# EAGLE design Porter (EAGLE 7.5.0)

## Sheet 1 of 2
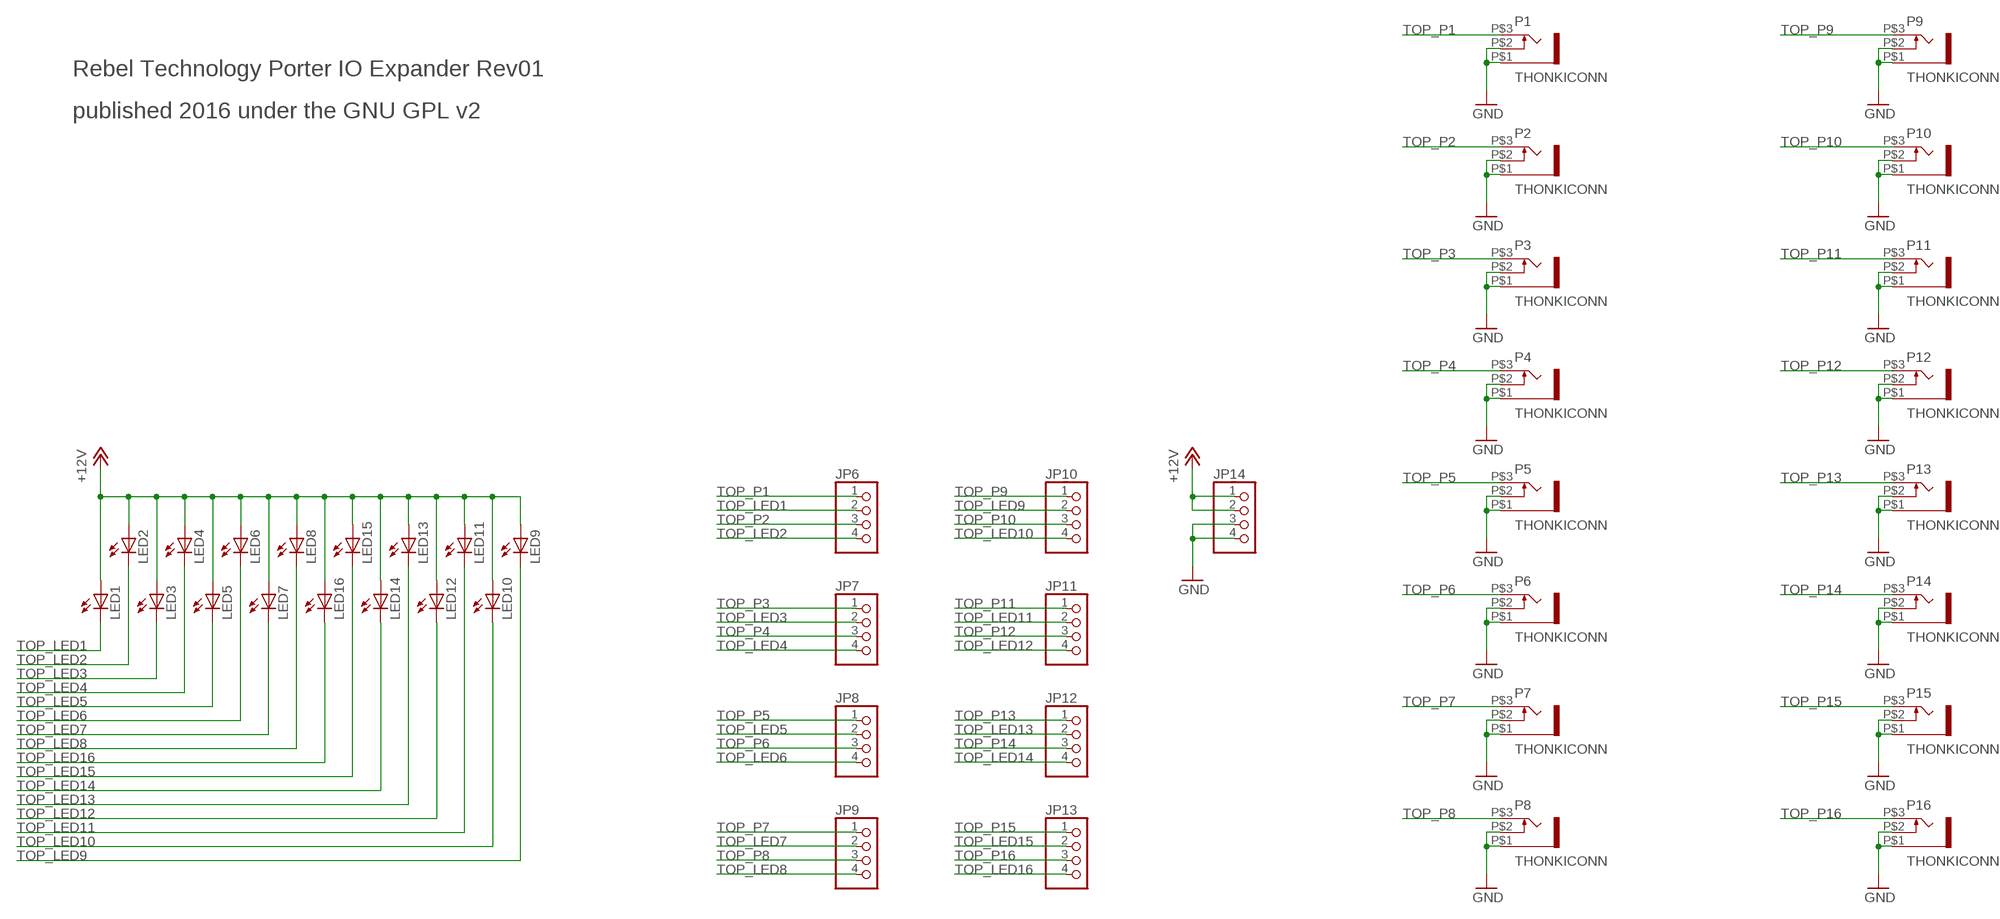
[diagram p0: schematic, sheet 1]

### Parts
JP6  PINHD-1X4  [1X04]
JP7  PINHD-1X4  [1X04]
JP8  PINHD-1X4  [1X04]
JP9  PINHD-1X4  [1X04]
JP10  PINHD-1X4  [1X04]
JP11  PINHD-1X4  [1X04]
JP12  PINHD-1X4  [1X04]
JP13  PINHD-1X4  [1X04]
JP14  PINHD-1X4  [1X04]
LED1  LED3MM  [LED3MM]
LED2  LED3MM  [LED3MM]
LED3  LED3MM  [LED3MM]
LED4  LED3MM  [LED3MM]
LED5  LED3MM  [LED3MM]
LED6  LED3MM  [LED3MM]
LED7  LED3MM  [LED3MM]
LED8  LED3MM  [LED3MM]
LED9  LED3MM  [LED3MM]
LED10  LED3MM  [LED3MM]
LED11  LED3MM  [LED3MM]
LED12  LED3MM  [LED3MM]
LED13  LED3MM  [LED3MM]
LED14  LED3MM  [LED3MM]
LED15  LED3MM  [LED3MM]
LED16  LED3MM  [LED3MM]
P1  THONKICONN  [THONKICONN]
P2  THONKICONN  [THONKICONN]
P3  THONKICONN  [THONKICONN]
P4  THONKICONN  [THONKICONN]
P5  THONKICONN  [THONKICONN]
P6  THONKICONN  [THONKICONN]
P7  THONKICONN  [THONKICONN]
P8  THONKICONN  [THONKICONN]
P9  THONKICONN  [THONKICONN]
P10  THONKICONN  [THONKICONN]
P11  THONKICONN  [THONKICONN]
P12  THONKICONN  [THONKICONN]
P13  THONKICONN  [THONKICONN]
P14  THONKICONN  [THONKICONN]
P15  THONKICONN  [THONKICONN]
P16  THONKICONN  [THONKICONN]

### Nets
TOP_+12V: JP14.1 JP14.2 LED1.A LED2.A LED3.A LED4.A LED5.A LED6.A LED7.A LED8.A LED9.A LED10.A LED11.A LED12.A LED13.A LED14.A LED15.A LED16.A ; supply symbol labelled +12V
TOP_GND: JP14.3 JP14.4 P1.P$1 P1.P$2 P2.P$1 P2.P$2 P3.P$1 P3.P$2 P4.P$1 P4.P$2 P5.P$1 P5.P$2 P6.P$1 P6.P$2 P7.P$1 P7.P$2 P8.P$1 P8.P$2 P9.P$1 P9.P$2 P10.P$1 P10.P$2 P11.P$1 P11.P$2 P12.P$1 P12.P$2 P13.P$1 P13.P$2 P14.P$1 P14.P$2 P15.P$1 P15.P$2 P16.P$1 P16.P$2 ; supply symbol labelled GND
TOP_LED1: JP6.2 LED1.K(C)
TOP_LED2: JP6.4 LED2.K(C)
TOP_LED3: JP7.2 LED3.K(C)
TOP_LED4: JP7.4 LED4.K(C)
TOP_LED5: JP8.2 LED5.K(C)
TOP_LED6: JP8.4 LED6.K(C)
TOP_LED7: JP9.2 LED7.K(C)
TOP_LED8: JP9.4 LED8.K(C)
TOP_LED9: JP10.2 LED9.K(C)
TOP_LED10: JP10.4 LED10.K(C)
TOP_LED11: JP11.2 LED11.K(C)
TOP_LED12: JP11.4 LED12.K(C)
TOP_LED13: JP12.2 LED13.K(C)
TOP_LED14: JP12.4 LED14.K(C)
TOP_LED15: JP13.2 LED15.K(C)
TOP_LED16: JP13.4 LED16.K(C)
TOP_P1: JP6.1 P1.P$3
TOP_P2: JP6.3 P2.P$3
TOP_P3: JP7.1 P3.P$3
TOP_P4: JP7.3 P4.P$3
TOP_P5: JP8.1 P5.P$3
TOP_P6: JP8.3 P6.P$3
TOP_P7: JP9.1 P7.P$3
TOP_P8: JP9.3 P8.P$3
TOP_P9: JP10.1 P9.P$3
TOP_P10: JP10.3 P10.P$3
TOP_P11: JP11.1 P11.P$3
TOP_P12: JP11.3 P12.P$3
TOP_P13: JP12.1 P13.P$3
TOP_P14: JP12.3 P14.P$3
TOP_P15: JP13.1 P15.P$3
TOP_P16: JP13.3 P16.P$3

### Notes on the sheet
- Rebel Technology Porter IO Expander Rev01
- published 2016 under the GNU GPL v2

## Sheet 2 of 2
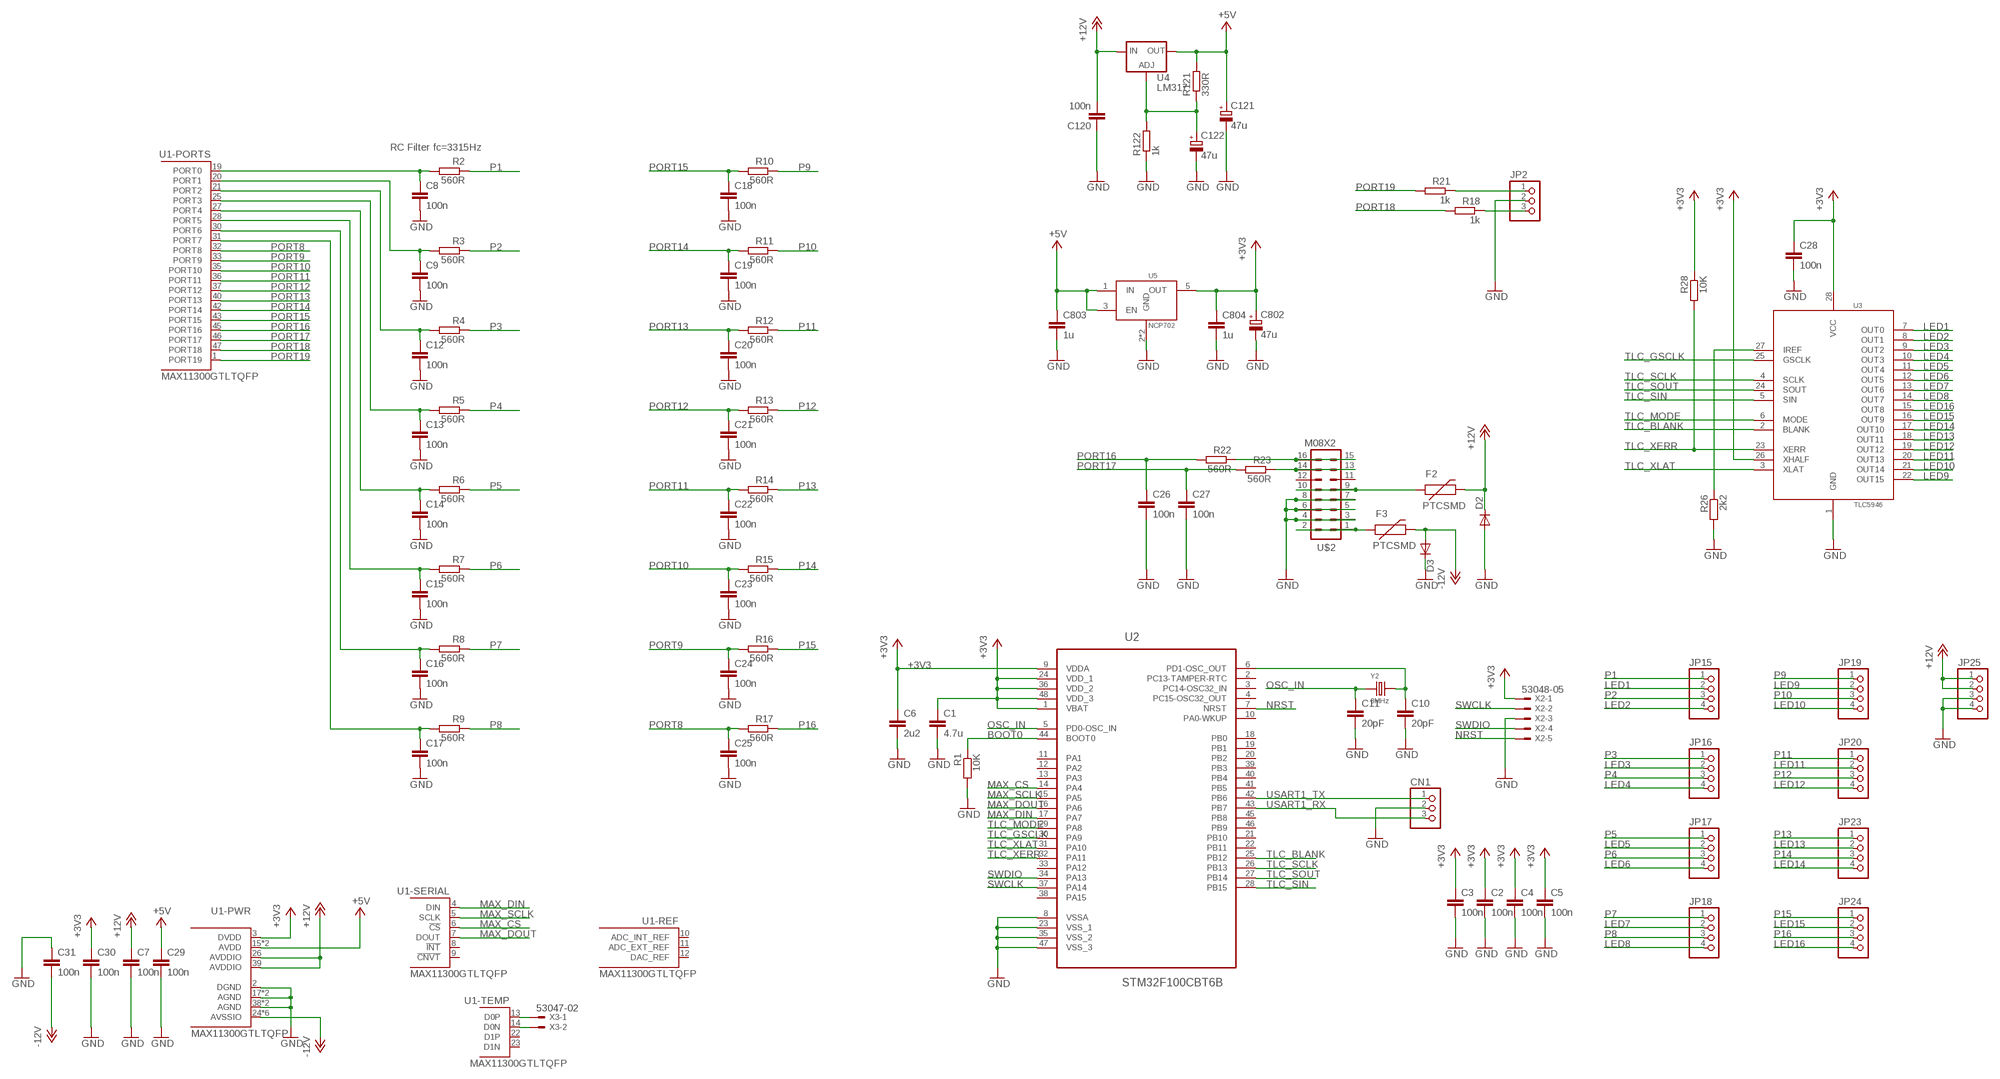
[diagram p1: schematic, sheet 2]

### Parts
C1  4.7u  C-EUC0603  [C0603]
C2  100n  C-EUC0603  [C0603]
C3  100n  C-EUC0603  [C0603]
C4  100n  C-EUC0603  [C0603]
C5  100n  C-EUC0603  [C0603]
C6  2u2  C-EUC0603  [C0603]
C7  100n  C-EUC0603  [C0603]
C8  100n  C-EUC0603  [C0603]
C9  100n  C-EUC0603  [C0603]
C10  20pF  C-EUC0603  [C0603]
C11  20pF  C-EUC0603  [C0603]
C12  100n  C-EUC0603  [C0603]
C13  100n  C-EUC0603  [C0603]
C14  100n  C-EUC0603  [C0603]
C15  100n  C-EUC0603  [C0603]
C16  100n  C-EUC0603  [C0603]
C17  100n  C-EUC0603  [C0603]
C18  100n  C-EUC0603  [C0603]
C19  100n  C-EUC0603  [C0603]
C20  100n  C-EUC0603  [C0603]
C21  100n  C-EUC0603  [C0603]
C22  100n  C-EUC0603  [C0603]
C23  100n  C-EUC0603  [C0603]
C24  100n  C-EUC0603  [C0603]
C25  100n  C-EUC0603  [C0603]
C26  100n  C-EUC0603  [C0603]
C27  100n  C-EUC0603  [C0603]
C28  100n  C-EUC0603  [C0603]
C29  100n  C-EUC0603  [C0603]
C30  100n  C-EUC0603  [C0603]
C31  100n  C-EUC0603  [C0603]
C120  100n  C-EUC0603  [C0603]
C121  47u  CPOL-EU153CLV-0505  [CPOL-5]
C122  47u  CPOL-EU153CLV-0505  [CPOL-5]
C802  47u  CPOL-EU153CLV-0505  [CPOL-5]
C803  1u  C-EUC0603  [C0603]
C804  1u  C-EUC0603  [C0603]
CN1  CON-JST-1X03PH-TH  [JST-B3B-PH-KL]
D2  DIODESMA  [SMA-DIODE]
D3  DIODESMA  [SMA-DIODE]
F2  PTCSMD  [PTC-1206]
F3  PTCSMD  [PTC-1206]
JP2  PINHD-1X3  [1X03]
JP15  PINHD-1X4  [1X04]
JP16  PINHD-1X4  [1X04]
JP17  PINHD-1X4  [1X04]
JP18  PINHD-1X4  [1X04]
JP19  PINHD-1X4  [1X04]
JP20  PINHD-1X4  [1X04]
JP23  PINHD-1X4  [1X04]
JP24  PINHD-1X4  [1X04]
JP25  PINHD-1X4  [1X04]
R1  10K  R-EU_0603  [0603]
R2  560R  R-EU_0603  [0603]
R3  560R  R-EU_0603  [0603]
R4  560R  R-EU_0603  [0603]
R5  560R  R-EU_0603  [0603]
R6  560R  R-EU_0603  [0603]
R7  560R  R-EU_0603  [0603]
R8  560R  R-EU_0603  [0603]
R9  560R  R-EU_0603  [0603]
R10  560R  R-EU_0603  [0603]
R11  560R  R-EU_0603  [0603]
R12  560R  R-EU_0603  [0603]
R13  560R  R-EU_0603  [0603]
R14  560R  R-EU_0603  [0603]
R15  560R  R-EU_0603  [0603]
R16  560R  R-EU_0603  [0603]
R17  560R  R-EU_0603  [0603]
R18  1k  R-EU_0603  [0603]
R21  1k  R-EU_0603  [0603]
R22  560R  R-EU_0603  [0603]
R23  560R  R-EU_0603  [0603]
R26  2k2  R-EU_0603  [0603]
R28  10K  R-EU_0603  [0603]
R121  330R  R-EU_0603  [0603]
R122  1k  R-EU_0603  [0603]
U1  MAX11300GTLTQFP  [TQFP48]
U2  STM32F100CBT6B  [QFP50P900X900X160-48N]
U3  TLC5946  [TSSOP28]
U4  LM317  LM317MSTT3  [SOT223]
U5  NCP702  [TSOP-5]
U$2  M08X2  [2X8]
X2  53048-05  [53048-05]
X3  53047-02  [53047-02]
Y2  8MHz  SMD-CRYSTAL-8MHZ-20PF-20PPM(2P-5.0X3.2MM)  [X2-SMD-5.0X3.2X1.3MM]

### Nets
+3V3: C1.1 C2.1 C3.1 C4.1 C5.1 C6.1 C28.1 C30.1 C802.+ C804.1 R28.1 U1.3(-PWR:DVDD) U2.1(VBAT) U2.9(VDDA) U2.24(VDD_1) U2.36(VDD_2) U2.48(VDD_3) U3.26(XHALF) U3.28(VCC) U5.5(OUT) X2.1
+5V: C29.1 C121.+ C803.1 R121.2 U1.15(-PWR:AVDD) U1.16(-PWR:AVDD) U4.2(OUT) U4.4(OUT) U5.1(IN) U5.3(EN)
+12V: C7.1 C120.2 D2.C F2.2 JP25.1 JP25.2 U1.26(-PWR:AVDDIO) U1.39(-PWR:AVDDIO) U4.3(IN)
-12V: C31.2 D3.A F3.2 U1.24(-PWR:AVSSIO) U1.29(-PWR:AVSSIO) U1.34(-PWR:AVSSIO) U1.41(-PWR:AVSSIO) U1.44(-PWR:AVSSIO) U1.48(-PWR:AVSSIO)
BOOT0: R1.1 U2.44(BOOT0)
GND: C1.2 C2.2 C3.2 C4.2 C5.2 C6.2 C7.2 C8.2 C9.2 C10.2 C11.2 C12.2 C13.2 C14.2 C15.2 C16.2 C17.2 C18.2 C19.2 C20.2 C21.2 C22.2 C23.2 C24.2 C25.2 C26.2 C27.2 C28.2 C29.2 C30.2 C31.1 C120.1 C121.- C122.- C802.- C803.2 C804.2 CN1.2 D2.A D3.C JP2.2 JP25.3 JP25.4 R1.2 R26.2 R122.1 U1.2(-PWR:DGND) U1.17(-PWR:AGND) U1.18(-PWR:AGND) U1.38(-PWR:AGND) U1.EP(-PWR:AGND) U2.8(VSSA) U2.23(VSS_1) U2.35(VSS_2) U2.47(VSS_3) U3.1(GND) U5.2(GND) U5.4(GND) U$2.3 U$2.4 U$2.5 U$2.6 U$2.7 U$2.8 X2.3
LED1: JP15.2 U3.7(OUT0)
LED2: JP15.4 U3.8(OUT1)
LED3: JP16.2 U3.9(OUT2)
LED4: JP16.4 U3.10(OUT3)
LED5: JP17.2 U3.11(OUT4)
LED6: JP17.4 U3.12(OUT5)
LED7: JP18.2 U3.13(OUT6)
LED8: JP18.4 U3.14(OUT7)
LED9: JP19.2 U3.22(OUT15)
LED10: JP19.4 U3.21(OUT14)
LED11: JP20.2 U3.20(OUT13)
LED12: JP20.4 U3.19(OUT12)
LED13: JP23.2 U3.18(OUT11)
LED14: JP23.4 U3.17(OUT10)
LED15: JP24.2 U3.16(OUT9)
LED16: JP24.4 U3.15(OUT8)
MAX_CS: U1.6(-SERIAL:!CS!) U2.14(PA4)
MAX_DIN: U1.4(-SERIAL:DIN) U2.17(PA7)
MAX_DOUT: U1.7(-SERIAL:DOUT) U2.16(PA6)
MAX_SCLK: U1.5(-SERIAL:SCLK) U2.15(PA5)
N$1: C10.1 U2.6(PD1-OSC_OUT) Y2.2
N$3: JP2.1 R21.1
N$6: F3.1 U$2.1 U$2.2
N$7: JP2.3 R18.1
N$8: R22.1 U$2.15 U$2.16
N$9: U1.13(-TEMP:D0P) X3.1
N$10: U1.14(-TEMP:D0N) X3.2
N$16: C122.+ R121.1 R122.2 U4.1(ADJ)
N$20: R23.1 U$2.13 U$2.14
N$43: R26.1 U3.27(IREF)
N$45: F2.1 U$2.9 U$2.10
NRST: U2.7(NRST) X2.5
OSC_IN: C11.1 U2.5(PD0-OSC_IN) Y2.1
P1: JP15.1 R2.1
P2: JP15.3 R3.1
P3: JP16.1 R4.1
P4: JP16.3 R5.1
P5: JP17.1 R6.1
P6: JP17.3 R7.1
P7: JP18.1 R8.1
P8: JP18.3 R9.1
P9: JP19.1 R10.1
P10: JP19.3 R11.1
P11: JP20.1 R12.1
P12: JP20.3 R13.1
P13: JP23.1 R14.1
P14: JP23.3 R15.1
P15: JP24.1 R16.1
P16: JP24.3 R17.1
PORT0: C8.1 R2.2 U1.19(-PORTS:PORT0)
PORT1: C9.1 R3.2 U1.20(-PORTS:PORT1)
PORT2: C12.1 R4.2 U1.21(-PORTS:PORT2)
PORT3: C13.1 R5.2 U1.25(-PORTS:PORT3)
PORT4: C14.1 R6.2 U1.27(-PORTS:PORT4)
PORT5: C15.1 R7.2 U1.28(-PORTS:PORT5)
PORT6: C16.1 R8.2 U1.30(-PORTS:PORT6)
PORT7: C17.1 R9.2 U1.31(-PORTS:PORT7)
PORT8: C25.1 R17.2 U1.32(-PORTS:PORT8)
PORT9: C24.1 R16.2 U1.33(-PORTS:PORT9)
PORT10: C23.1 R15.2 U1.35(-PORTS:PORT10)
PORT11: C22.1 R14.2 U1.36(-PORTS:PORT11)
PORT12: C21.1 R13.2 U1.37(-PORTS:PORT12)
PORT13: C20.1 R12.2 U1.40(-PORTS:PORT13)
PORT14: C19.1 R11.2 U1.42(-PORTS:PORT14)
PORT15: C18.1 R10.2 U1.43(-PORTS:PORT15)
PORT16: C26.1 R22.2 U1.45(-PORTS:PORT16)
PORT17: C27.1 R23.2 U1.46(-PORTS:PORT17)
PORT18: R18.2 U1.47(-PORTS:PORT18)
PORT19: R21.2 U1.1(-PORTS:PORT19)
SWCLK: U2.37(PA14) X2.2
SWDIO: U2.34(PA13) X2.4
TLC_BLANK: U2.25(PB12) U3.2(BLANK)
TLC_GSCLK: U2.30(PA9) U3.25(GSCLK)
TLC_MODE: U2.29(PA8) U3.6(MODE)
TLC_SCLK: U2.26(PB13) U3.4(SCLK)
TLC_SIN: U2.28(PB15) U3.5(SIN)
TLC_SOUT: U2.27(PB14) U3.24(SOUT)
TLC_XERR: R28.2 U2.32(PA11) U3.23(XERR)
TLC_XLAT: U2.31(PA10) U3.3(XLAT)
USART1_RX: CN1.3 U2.43(PB7)
USART1_TX: CN1.1 U2.42(PB6)
Unconnected: U1.8(-SERIAL:!INT!) U1.9(-SERIAL:!CNVT!) U1.10(-REF:ADC_INT_REF) U1.11(-REF:ADC_EXT_REF) U1.12(-REF:DAC_REF) U1.22(-TEMP:D1P) U1.23(-TEMP:D1N) U2.2(PC13-TAMPER-RTC) U2.3(PC14-OSC32_IN) U2.4(PC15-OSC32_OUT) U2.10(PA0-WKUP) U2.11(PA1) U2.12(PA2) U2.13(PA3) U2.18(PB0) U2.19(PB1) U2.20(PB2) U2.21(PB10) U2.22(PB11) U2.33(PA12) U2.38(PA15) U2.39(PB3) U2.40(PB4) U2.41(PB5) U2.45(PB8) U2.46(PB9) U$2.11 U$2.12

### Notes on the sheet
- RC Filter fc=3315Hz

## Library data of the parts
C1-C31 C120 C803 C804 = Rebel:C-EU: CAPACITOR, European symbol
C121 C122 C802 = Rebel:CPOL-EU: POLARIZED CAPACITOR, European symbol
CN1 = Rebel:CON-JST-1X03
D2 D3 = SparkFun:DIODE: Diode These are standard reverse protection diodes and small signal diodes. SMA package can handle up to about 1A. SOD-323 can handle about 200mA. What the SOD-323 package when ordering, there are some mfgs out there that are 5-pin packages.
F2 F3 = SparkFun:PTC: Resettable Fuse PTC Resettable Fuse. Spark Fun Electronics SKU : COM-08357
JP2 = pinhead:PINHD-1X3: PIN HEADER
JP6-JP20 JP23-JP25 = pinhead:PINHD-1X4: PIN HEADER
LED1-LED16 = Rebel:LED: LED
P1-P16 = Rebel:THONKICONN
R1-R18 R21-R23 R26 R28 R121 R122 = Rebel:R-EU_: RESISTOR, European symbol
U1 = Rebel:MAX11300GTL: 12 BIT ADC / DAC
U2 = Rebel:STM32F100CBT6B: ARM-based 32-bit MCU; MPN: STM32F100CBT6B; OC_FARNELL: 1838512; OC_NEWARK: 86R1308; PACKAGE: LQFP-48; SUPPLIER: STMircroelectronics
U3 = Rebel:TLC5946
U4 = v-reg:LM317?*: 500 mA Adjustable Output Positive Voltage Regulator Source: http://www.onsemi.co.jp .. LM317M-D.PDF
U5 = Rebel:NCP702
U$2 = SparkFun:M08X2
X2 = con-molex:53?-05: CONNECTOR wire to board 1.25 mm (.049 inch) pitch header; MF: MOLEX; MPN: 53048-0510; OC_FARNELL: 9732926; OC_NEWARK: 57H4722
X3 = con-molex:53?-02: CONNECTOR wire to board 1.25 mm (.049 inch) pitch header; MF: MOLEX; MPN: 53047-0210; OC_FARNELL: 9733051; OC_NEWARK: 57H4701
Y2 = Seeed-OPL-crystal-osctllator:SMD-CRYSTAL-8MHZ-20PF-20PPM(2P-5.0X3.2MM): 306010004; MPN: 5032/2P; VALUE: 5032/2p

## Board
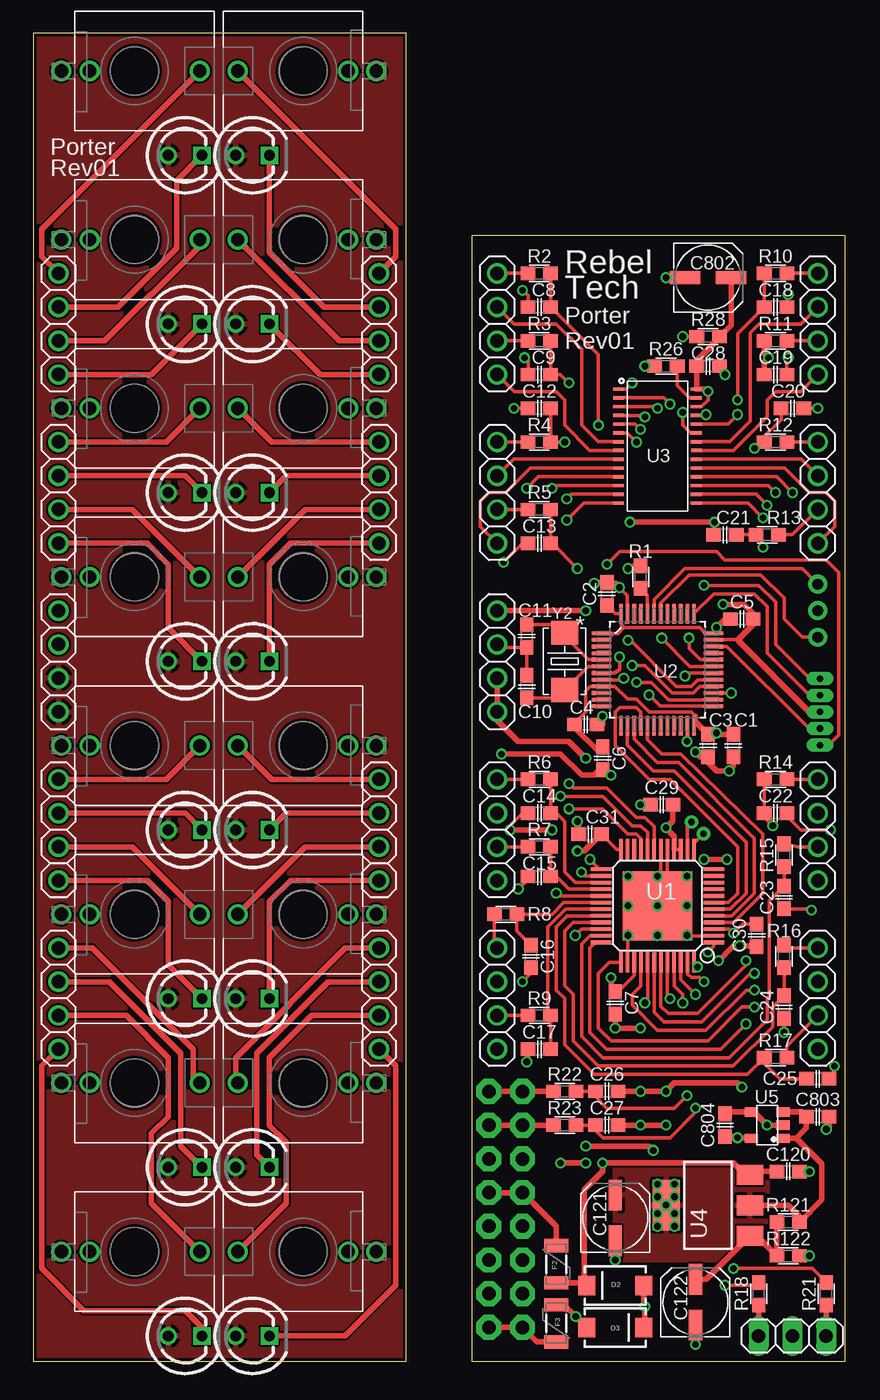
[diagram p2: board, top side]
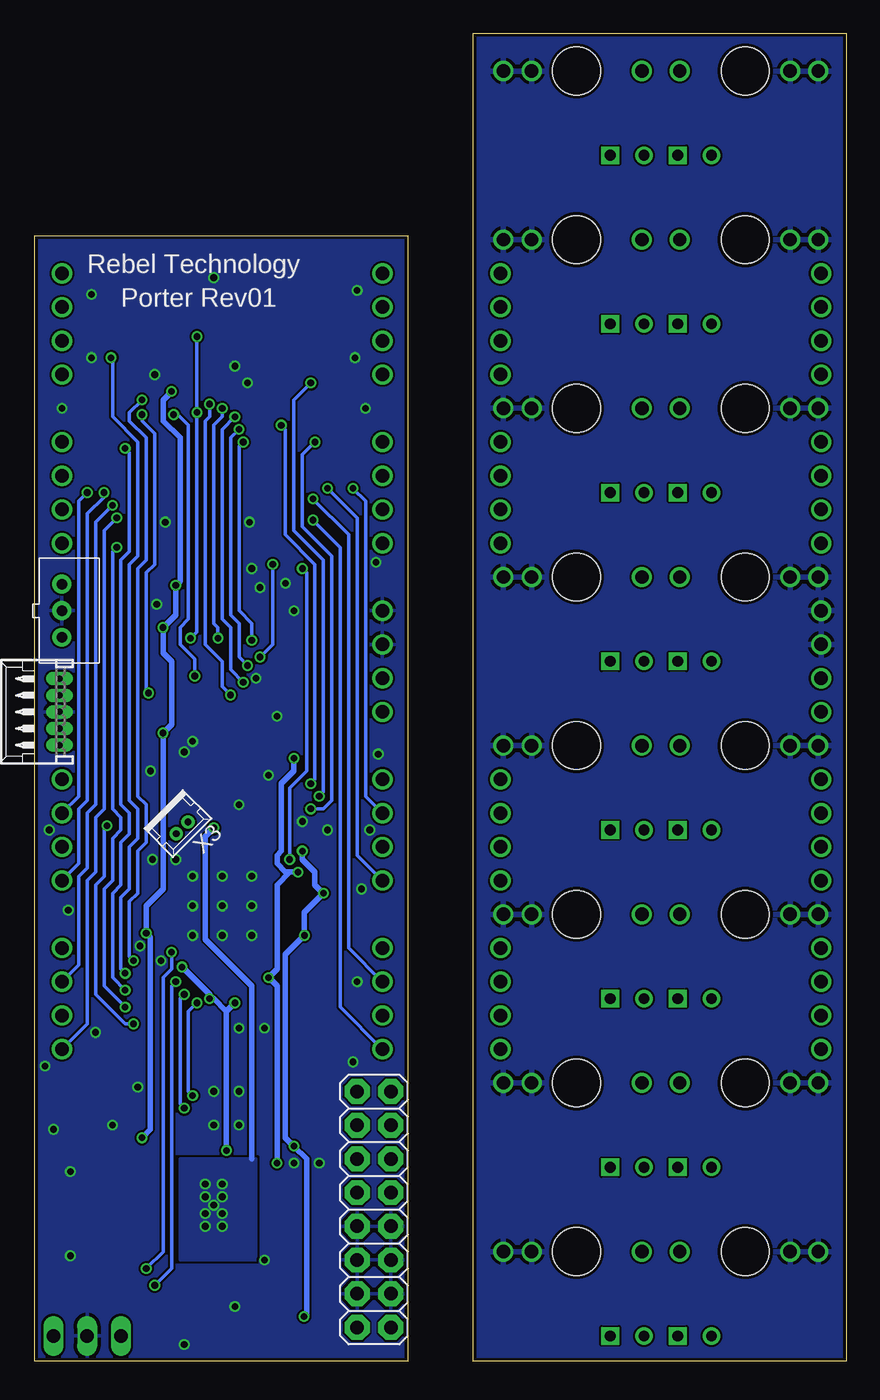
[diagram p3: board, bottom side, seen from below]

Size 61.12 x 100 mm. Coordinates in mm from the lower left corner, seen from the top.
Outline: 0,0 28.09,0 28.09,100 0,100 0,0
Outline: 33.02,84.76 33.02,0 61.12,0 61.12,84.76 33.02,84.76
Copper layers (1*16): Top 0.035mm / dielectric 1.5mm / Bottom 0.035mm
Design rules "SeeedStudio_2layer_DRU_no_angle_20140221": minimum track width 6mil, minimum drill 12mil, track to track 6mil, track to pad 6mil, pad to pad 6mil, via to via 6mil, smd to smd 0mil, copper to edge 10mil, drill to drill 10mil, minimum pad ring 10mil, minimum via ring 6mil, stop-mask expansion 2mil, vias tented up to drill 100mil, thermal gap 10mil

### Footprints (pad centres in the part's own frame; a part is rotated, then mirrored left to right if it is on the bottom)
C0603 = smd 1.1 x 1: 1 -0.85,0; 2 0.85,0
CPOL-5 = smd 2.3 x 1: + 1.725,0; - -1.725,0
JST-B3B-PH-KL = drill 0.8 pad 1.422: 1 2,0; 2 0,0; 3 -2,0
SMA-DIODE = smd 1.27 x 1.47: A -2.15,0; C 2.15,0
PTC-1206 = smd 1 x 1.8: 1 -1.4,0; 2 1.4,0
1X03 = drill 1.016 long: 1 -2.54,0; 2 0,0; 3 2.54,0
1X04 = drill 1.016: 1 -3.81,0; 2 -1.27,0; 3 1.27,0; 4 3.81,0
LED3MM = drill 0.813: A -1.27,0 | drill 0.813 square: K 1.27,0
THONKICONN = drill 1: P$1 0,-5.5; P$2 0,-3.38; P$3 0,4.92 | hole 3.6: 0,0
0603 = smd 1.1 x 1: 1 -0.85,0; 2 0.85,0
TQFP48 = smd 0.27 x 1.55: 1 -2.75,-4.25; 2 -2.25,-4.25; 3 -1.75,-4.25; 4 -1.25,-4.25; 5 -0.75,-4.25; 6 -0.25,-4.25; 7 0.25,-4.25; 8 0.75,-4.25; 9 1.25,-4.25; 10 1.75,-4.25; 11 2.25,-4.25; 12 2.75,-4.25; 25 2.75,4.25; 26 2.25,4.25; 27 1.75,4.25; 28 1.25,4.25; 29 0.75,4.25; 30 0.25,4.25; 31 -0.25,4.25; 32 -0.75,4.25; 33 -1.25,4.25; 34 -1.75,4.25; 35 -2.25,4.25; 36 -2.75,4.25 | smd 1.55 x 0.27: 13 4.25,-2.75; 14 4.25,-2.25; 15 4.25,-1.75; 16 4.25,-1.25; 17 4.25,-0.75; 18 4.25,-0.25; 19 4.25,0.25; 20 4.25,0.75; 21 4.25,1.25; 22 4.25,1.75; 23 4.25,2.25; 24 4.25,2.75; 37 -4.25,2.75; 38 -4.25,2.25; 39 -4.25,1.75; 40 -4.25,1.25; 41 -4.25,0.75; 43 -4.25,-0.25; 44 -4.25,-0.75; 45 -4.25,-1.25; 46 -4.25,-1.75; 47 -4.25,-2.25; 48 -4.25,-2.75 | smd 1.5 x 0.3: 42 -4.25,0.25 | smd 5.22 x 5.22: EP 0,0
QFP50P900X900X160-48N = smd 1.473 x 0.279: 1 -4.216,2.743; 2 -4.216,2.261; 3 -4.216,1.753; 4 -4.216,1.245; 5 -4.216,0.762; 6 -4.216,0.254; 7 -4.216,-0.254; 8 -4.216,-0.762; 9 -4.216,-1.245; 10 -4.216,-1.753; 11 -4.216,-2.261; 12 -4.216,-2.743; 25 4.216,-2.743; 26 4.216,-2.261; 27 4.216,-1.753; 28 4.216,-1.245; 29 4.216,-0.762; 30 4.216,-0.254; 31 4.216,0.254; 32 4.216,0.762; 33 4.216,1.245; 34 4.216,1.753; 35 4.216,2.261; 36 4.216,2.743 | smd 0.279 x 1.473: 13 -2.743,-4.216; 14 -2.261,-4.216; 15 -1.753,-4.216; 16 -1.245,-4.216; 17 -0.762,-4.216; 18 -0.254,-4.216; 19 0.254,-4.216; 20 0.762,-4.216; 21 1.245,-4.216; 22 1.753,-4.216; 23 2.261,-4.216; 24 2.743,-4.216; 37 2.743,4.216; 38 2.261,4.216; 39 1.753,4.216; 40 1.245,4.216; 41 0.762,4.216; 42 0.254,4.216; 43 -0.254,4.216; 44 -0.762,4.216; 45 -1.245,4.216; 46 -1.753,4.216; 47 -2.261,4.216; 48 -2.743,4.216
TSSOP28 = smd 0.8 x 0.25: 1 -2.921,4.623; 2 -2.921,3.962; 3 -2.921,3.302; 4 -2.921,2.642; 5 -2.921,1.981; 6 -2.921,1.321; 7 -2.921,0.66; 8 -2.927,0; 9 -2.921,-0.66; 10 -2.921,-1.321; 11 -2.921,-1.981; 12 -2.921,-2.642; 13 -2.921,-3.302; 14 -2.921,-3.962; 15 2.921,-3.962; 16 2.921,-3.302; 17 2.921,-2.642; 18 2.921,-1.981; 19 2.921,-1.321; 20 2.921,-0.66; 21 2.927,0; 22 2.921,0.66; 23 2.921,1.321; 24 2.921,1.981; 25 2.921,2.642; 26 2.921,3.302; 27 2.921,3.962; 28 2.921,4.623
SOT223 = smd 1.5 x 2: 1 -2.3,-3.15; 2 0,-3.15; 3 2.3,-3.15 | smd 3.8 x 2: 4 0,3.15
TSOP-5 = smd 0.7 x 1: 1 -0.99,-1.2; 2 0,-1.2; 3 0.99,-1.2; 4 0.99,1.2; 5 -0.99,1.2
2X8 = drill 1.016 pad 1.88 octagon: 1 0,0; 2 0,2.54; 3 2.54,0; 4 2.54,2.54; 5 5.08,0; 6 5.08,2.54; 7 7.62,0; 8 7.62,2.54; 9 10.16,0; 10 10.16,2.54; 11 12.7,0; 12 12.7,2.54; 13 15.24,0; 14 15.24,2.54; 15 17.78,0; 16 17.78,2.54
53048-05 = drill 0.5 pad 0.698 long: 1 2.5,-1.25; 2 1.25,-1.25; 3 0,-1.25; 4 -1.25,-1.25; 5 -2.5,-1.25
53047-02 = drill 0.5 pad 0.698: 1 0.625,0.45; 2 -0.625,0.45
X2-SMD-5.0X3.2X1.3MM = smd 1.778 x 2.032: 1 -2.159,0; 2 2.159,0

### Placement (x,y rotation side)
C1  52.7,46.35 270 top
C2  43.18,57.78 90 top
C3  50.8,46.35 270 top
C4  41.59,47.94 0 top
C5  53.34,55.88 0 top
C6  42.86,45.4 270 top
C7  43.81,26.99 270 top
C8  38.1,79.38 180 top
C9  38.1,74.3 180 top
C10  37.15,50.8 90 top
C11  37.15,54.61 270 top
C12  38.1,71.75 180 top
C13  38.1,61.59 180 top
C14  38.1,41.27 180 top
C15  38.1,36.51 180 top
C16  37.47,30.48 270 top
C17  38.1,23.5 180 top
C18  55.88,79.38 0 top
C19  55.88,74.3 0 top
C20  57.15,71.75 0 top
C21  52.07,62.23 180 top
C22  55.88,41.27 0 top
C23  56.52,34.92 270 top
C24  56.52,26.67 270 top
C25  59.05,21.27 0 top
C26  43.18,20.32 0 top
C27  43.18,17.78 0 top
C28  50.8,74.93 0 top
C29  47.31,41.91 180 top
C30  54.45,32.07 270 top
C31  41.91,39.69 0 top
C120  56.83,14.29 180 top
C121  43.81,10.79 90 top
C122  49.85,4.45 90 top
C802  50.8,81.6 0 top
C803  59.05,18.41 0 top
C804  52.07,17.78 90 top
CN1  59.05,56.52 270 bottom
D2  43.81,5.71 180 top
D3  43.81,2.54 0 top
F2  39.37,7.3 270 top
F3  39.37,2.86 90 top
JP2  57.15,1.91 180 top
JP6  1.91,78.11 270 top
JP7  1.91,65.41 270 top
JP8  1.91,40.01 270 top
JP9  1.91,27.3 270 top
JP10  26.04,78.11 270 top
JP11  26.04,65.41 270 top
JP12  26.04,40.01 270 top
JP13  26.04,27.3 270 top
JP14  1.91,52.7 90 top
JP15  34.92,78.11 270 top
JP16  34.92,65.41 270 top
JP17  34.92,40.01 270 top
JP18  34.92,27.3 270 top
JP19  59.05,78.11 270 top
JP20  59.05,65.41 270 top
JP23  59.05,40.01 270 top
JP24  59.05,27.3 270 top
JP25  34.92,52.7 90 top
LED1  11.43,90.81 0 top
LED2  11.43,78.11 0 top
LED3  11.43,65.41 0 top
LED4  11.43,52.7 0 top
LED5  11.43,40.01 0 top
LED6  11.43,27.3 0 top
LED7  11.43,14.61 0 top
LED8  11.43,1.91 0 top
LED9  16.51,90.81 0 top
LED10  16.51,78.11 0 top
LED11  16.51,65.41 0 top
LED12  16.51,52.7 0 top
LED13  16.51,40.01 0 top
LED14  16.51,27.3 0 top
LED15  16.51,14.61 0 top
LED16  16.51,1.91 0 top
P1  7.62,97.16 270 top
P2  7.62,84.45 270 top
P3  7.62,71.75 270 top
P4  7.62,59.05 270 top
P5  7.62,46.35 270 top
P6  7.62,33.66 270 top
P7  7.62,20.95 270 top
P8  7.62,8.26 270 top
P9  20.32,97.16 90 top
P10  20.32,84.45 90 top
P11  20.32,71.75 90 top
P12  20.32,59.05 90 top
P13  20.32,46.35 90 top
P14  20.32,33.66 90 top
P15  20.32,20.95 90 top
P16  20.32,8.26 90 top
R1  45.72,59.05 90 top
R2  38.1,81.92 0 top
R3  38.1,76.83 0 top
R4  38.1,69.22 0 top
R5  38.1,64.14 0 top
R6  38.1,43.81 0 top
R7  38.1,38.73 0 top
R8  35.56,33.66 0 top
R9  38.1,26.04 0 top
R10  55.88,81.92 180 top
R11  55.88,76.83 180 top
R12  55.88,69.22 180 top
R13  55.24,62.23 180 top
R14  55.88,43.81 180 top
R15  56.52,38.1 270 top
R16  56.52,30.48 270 top
R17  55.88,22.86 180 top
R18  54.61,5.08 90 top
R21  59.69,5.08 90 top
R22  40.01,20.32 0 top
R23  40.01,17.78 0 top
R26  47.62,74.93 180 top
R28  50.8,77.15 180 top
R121  56.83,10.48 0 top
R122  56.83,7.94 180 top
U1  46.99,34.29 90 top
U2  46.99,52.07 0 top
U3  46.99,68.58 0 top
U4  50.8,11.75 90 top
U5  55.24,17.78 90 top
U$2  34.29,2.54 90 bottom
X2  60.48,48.9 90 bottom
X3  50.32,40.48 225 bottom
Y2  40.01,52.7 270 top

### Tracks (layer width: path | path; a pad name or v marks a point on that pad's centre or on a via)
+3V3  (via drill 0.5)
  Top 0.254: U1.3 52.39,32.54 v52.7,32.23 53.4,32.92 C30.1 | 44.45,55.24 50.16,55.24 50.6,54.81 U2.36 51.44,55.04 v51.44,55.24 | 44.45,55.24 44.25,55.45 U2.48 43.83,56.29 C2.1 | 44.45,55.24 44.02,54.81 U2.1 | U3.26 50.29,71.88 50.8,72.39 v50.8,73.03 | 49.85,48.58 49.53,48.9 46.35,48.9 45.4,49.85 44.77,49.85 43.79,50.83 U2.9 41.94,50.83 41.59,50.48 41.59,48.9 40.74,48.05 C4.1 | U2.24 49.76,47.85 49.95,48.05 | v50.48,58.42 54.61,58.42 55.88,57.15 55.88,53.98 58.42,51.44 59.19,51.44 X2.1
  Top 0.406: C4.1 40.74,47.74 42.55,45.94 C6.1 | 49.85,48.58 49.85,48.16 49.95,48.05 C3.1 51.33,47.2 v51.44,47.31 51.54,47.2 C1.1 | C5.1 52.07,55.88 v51.44,55.24 | C802.+ 52.52,78.03 R28.1 51.65,77.05 49.95,75.35 C28.1 49.95,73.24 U3.28 50.62,73.2 v50.8,73.03 | U5.5 54.01,16.83 v53.02,16.83 52.92,16.93 C804.1
  Bottom 0.406: v53.02,16.83 52.39,17.46 52.39,31.91 v52.7,32.23 52.7,34.29 51.44,35.56 v51.44,47.31 50.8,47.94 50.8,52.7 51.44,53.34 v51.44,55.24 50.48,56.2 v50.48,58.42 50.16,58.74 50.16,69.53 51.44,70.8 51.44,72.39 v50.8,73.03
+5V  (via drill 0.5)
  Top 0.254: U1.15 U1.16 48.26,38.56
  Top 0.406: C29.1 48.16,40.7 v47.62,40.16 48.26,39.53 48.26,38.56 | U5.3 57.85,18.77 C803.1 58.2,17.57 57.43,16.79 | 43.63,13.02 C121.+ | 47.31,13.02 47.62,12.7 47.62,11.77 U4.4 | U5.1 57.43,16.79 | 57.43,16.79 59.37,14.85 59.37,12.17 R121.2 57.78,10.58 57.78,10.79 56.83,11.75 U4.2
  Bottom 0.406: v47.62,40.16 48.26,39.53 48.26,31.75 44.77,28.26 44.77,15.24
  other vias: 46.99,13.34 48.26,13.34 48.26,11.11 46.99,11.11 46.99,10.16 48.26,10.16 46.99,12.38 48.26,12.38 47.62,11.75
  pour Top: 43.81,15.88 43.81,7.62 55.24,7.62 55.24,15.88
  pour Bottom: 44.45,15.24 50.16,15.24 50.16,7.62 44.45,7.62
+12V  (via drill 0.5)
  Top 0.254: U1.26 41.56,36.54 v41.27,36.83 | U1.39 45.24,29.05 44.03,27.84 C7.1
  Top 0.406: v41.59,45.4 40.32,46.67 36.51,46.67 34.92,48.26 JP25.1 JP25.2 | v43.5,28.89 43.5,28.16 C7.1 | 53.87,13.97 U4.3 | C120.2 54.19,14.29 U4.3 | F2.2 41.48,5.9 | 41.48,5.9 D2.C | 41.48,5.9 41.48,12.9 42.86,14.29 v42.86,14.92 52.7,14.92 53.58,14.05 U4.3
  Bottom 0.406: v42.86,14.92 42.86,28.26 v43.5,28.89 42.86,29.53 42.86,35.88 41.91,36.83 | v41.59,45.4 41.59,44.45 42.55,43.5 42.55,38.42 42.86,38.1 42.86,37.47 42.23,36.83 41.91,36.83 | v41.27,36.83 41.91,36.83
-12V  (via drill 0.5)
  Top 0.254: U1.29 39.48,35.04 v39.37,35.24 | U1.34 41.27,32.54 v40.8,32.07 | U1.44 47.74,27.51 v47.94,27.3 | U1.48 49.81,30.04 v50.01,29.69 | U1.41 46.24,27.19 v46.04,26.99 | U1.24 43.91,38.54 C31.2
  Top 0.406: v40.96,38.42 41.49,38.42 C31.2 | F3.2 39.95,4.26 v40.84,3.37 D3.A | v41.59,16.19 46.35,16.19 v46.67,15.88
  Bottom 0.406: v50.01,29.69 47.94,27.62 v47.94,27.3 47.62,27.3 46.67,26.35 | v40.96,38.42 40.96,37.78 40.01,36.83 40.01,35.88 v39.37,35.24 40.8,33.81 v40.8,32.07 42.23,30.64 42.23,16.83 v41.59,16.19 40.64,15.24 40.64,3.56 v40.84,3.37 | v46.04,26.99 46.67,26.35 | 46.67,26.35 v46.67,15.88
BOOT0
  Top 0.254: U2.44 46.23,57.7 R1.1
GND  (via drill 0.5)
  Top 0.254: 37.25,41.49 C14.2 36.83,41.27 35.88,40.32 v35.88,40.01 | U1.18 47.24,34.54 U1.EP | U1.17 47.74,35.04 U1.EP | U1.2 49.24,32.04 U1.EP | U1.38 44.74,32.04 U1.EP | C24.2 v56.52,24.77 | C16.2 37.47,29.21 v36.83,28.57 | C17.2 37.25,22.64 v37.15,22.54 | C15.2 37.25,36.3 v36.51,35.56 | U3.1 44.63,73.2 v45.09,73.66 | C9.2 37.25,75.35 v36.99,75.56 | C8.2 37.25,80.22 v36.83,80.64 | C12.2 v36.2,71.75 | C25.2 60.22,21.49 v60.33,22.23 | C10.2 C11.2 35.14,53.76 JP25.3 | U2.23 49.25,46.71 v49.21,46.67 | U2.47 44.73,57.66 v44.13,58.26 | R1.2 44.98,59.91 v44.77,59.69 | U2.8 44.32,51.31 v44.45,51.44 | C22.2 56.73,41.06 57.78,40.01 v60.01,40.01 | C19.2 56.73,75.46 v56.83,75.56 | C18.2 56.73,80.22 v56.83,80.33 | C20.2 v59.05,71.75 | C21.2 51.22,63.13 | U2.35 53.06,54.33 | C13.2 36.83,61.59 v35.4,60.17 | C23.2 58.48,34.08 v58.58,33.97
  Top 0.406: JP25.4 v41.59,56.52 | v35.88,40.01 v39.05,40.01 | C27.2 v45.72,17.78 v47.62,17.78 | C4.2 42.86,47.94 v42.86,48.58 | C1.2 52.7,44.77 v52.39,44.45 51.44,44.45 50.8,45.09 C3.2 50.22,45.51 v49.85,45.88 | R26.2 v46.04,74.93 | C28.2 51.65,74.72 v52.07,74.3 | v53.34,20.64 53.02,20.95 48.26,20.95 v47.62,20.32 v45.72,20.32 C26.2 | v45.72,25.08 v43.81,25.08 C7.2 | v51.91,56.99 53.5,56.99 54.19,56.3 C5.2 54.19,55.46 53.06,54.33 53.06,54.25 58.42,48.9 X2.3 | C802.- v47.62,81.6 | C29.2 v45.72,41.91 | v51.59,30.16 52.65,31.22 53.12,31.22 v53.18,31.27 54.4,31.27 C30.2 | v50.48,37.78 v52.23,37.78 | C31.1 41.06,40.54 v40.96,40.64 | 42.65,44.55 42.23,44.13 41.27,44.13 39.69,45.72 v35.24,45.72 | C6.2 43.08,44.55 v43.5,44.13 | C2.2 42.28,58.63 v42.23,58.58 | v44.13,58.26 43.81,58.58 43.34,58.58 43.18,58.42 | v44.93,63.18 51.16,63.18 51.22,63.13 | C804.2 52.21,18.77 U5.4 54.26,18.77 v55.24,17.78 U5.2 | C803.2 59.91,17.57 v59.69,17.46 | C120.1 v58.42,14.29 | C121.- v43.81,7.62 | D2.A 45.97,4.2 v46.04,4.13 46.04,2.61 D3.C | C122.- v49.85,1.27 | v39.69,14.92 v41.59,14.92 | R122.1 v58.42,7.94
  other vias: 46.99,34.29 44.77,32.07 49.21,32.07 49.21,36.51 44.77,36.51 46.99,36.51 46.99,32.07 49.21,34.29 44.77,34.29 51.28,63.18
  pour Bottom (rank 2): 33.02,86.36 62.23,86.36 62.23,-1.27 33.02,-1.27 33.02,85.09
LED1
  Top 0.254: U3.7 42.52,69.24 41.27,70.48 41.27,76.2 39.37,78.11 36.2,78.11 JP15.2
LED2
  Top 0.254: U3.8 41.91,68.58 40.01,70.48 40.01,72.39 39.37,73.03 36.2,73.03 JP15.4
LED3
  Top 0.254: JP16.2 36.17,67.92 U3.9
LED4
  Top 0.254: U3.10 37.41,67.26 35.56,65.41 34.29,65.41 33.66,64.77 33.66,62.87 JP16.4
LED5  (via drill 0.5)
  Top 0.254: U3.11 38.02,66.6 v37.15,65.72
  Bottom 0.254: JP17.2 36.2,42.55 36.2,64.77 v37.15,65.72
LED6  (via drill 0.5)
  Top 0.254: U3.12 39.27,65.94 v39.05,65.72
  Bottom 0.254: JP17.4 36.83,38.1 36.83,63.5 v39.05,65.72
LED7  (via drill 0.5)
  Top 0.254: U3.13 40.51,65.28 v40.16,64.93
  Bottom 0.254: v40.16,64.93 37.47,62.23 37.47,31.11 JP18.2
LED8  (via drill 0.5)
  Top 0.254: U3.14 41.44,64.62 v40.16,63.34
  Bottom 0.254: JP18.4 38.1,26.67 38.1,61.28 v40.16,63.34
LED9
  Top 0.254: U3.22 52.41,69.24 53.98,70.8 53.98,77.47 54.61,78.11 57.78,78.11 JP19.2
LED10
  Top 0.254: U3.21 52.7,68.58 55.24,71.12 55.24,72.39 55.88,73.03 57.78,73.03 JP19.4
LED11
  Top 0.254: U3.20 57.81,67.92 JP20.2
LED12
  Top 0.254: JP20.4 60.33,62.87 60.33,64.77 59.69,65.41 58.42,65.41 56.57,67.26 U3.19
LED13  (via drill 0.5)
  Top 0.254: v57.15,65.41 55.96,66.6 U3.18
  Bottom 0.254: JP23.2 57.78,42.55 57.78,64.77 v57.15,65.41
LED14  (via drill 0.5)
  Top 0.254: U3.17 55.35,65.94 v55.88,65.41
  Bottom 0.254: JP23.4 57.78,37.47 57.78,41.59 57.15,42.23 57.15,63.82 55.88,65.09 v55.88,65.41
LED15  (via drill 0.5)
  Top 0.254: U3.16 54.42,65.28 v55.24,64.45
  Bottom 0.254: JP24.2 57.78,29.84 57.78,36.51 57.15,37.15 57.15,41.27 56.52,41.91 56.52,63.18 v55.24,64.45
LED16  (via drill 0.5)
  Top 0.254: U3.15 53.81,64.62 v54.93,63.5
  Bottom 0.254: JP24.4 57.15,25.4 57.15,36.2 56.52,36.83 56.52,40.96 55.88,41.59 55.88,62.55 v54.93,63.5
MAX_CS
  Top 0.254: U1.6 52.45,34.04 53.66,35.24 53.66,39.05 48.26,44.45 46.67,44.45 44.73,46.39 U2.14
MAX_DIN
  Top 0.254: U1.4 52.73,33.04 54.93,35.24 54.93,39.69 48.74,45.72 47.31,45.72 46.23,46.8 U2.17
MAX_DOUT
  Top 0.254: U1.7 52.32,34.54 53.02,35.24 53.02,38.73 47.94,43.81 46.35,43.81 43.81,46.35 43.81,48.9 44.13,49.21 45.4,49.21 45.74,48.87 U2.16
MAX_SCLK
  Top 0.254: U1.5 52.59,33.54 54.29,35.24 54.29,39.37 48.58,45.09 46.99,45.09 45.24,46.84 U2.15
N$1
  Top 0.254: C10.1 39.41,49.95 Y2.2 41.78,52.32 U2.6
N$3
  Top 0.406: R21.1 JP2.1
N$6
  Top 0.406: U$2.1 U$2.2 37.91,1.46 F3.1
N$7
  Top 0.406: R18.1 JP2.3
N$8
  Top 0.406: R22.1 U$2.16 U$2.15
N$9
  Top 0.254: U1.13 49.74,39.01 X3.1
N$10
  Top 0.254: U1.14 49.24,40.28 X3.2
N$16
  Top 0.406: R121.1 R122.2 54.47,9.45 U4.1 50.67,6.17 C122.+
N$20
  Top 0.406: R23.1 U$2.14 U$2.13
N$43
  Top 0.254: U3.27 49.38,72.54 48.48,73.44 R26.1
N$45
  Top 0.406: U$2.9 U$2.10 39.37,10.16 F2.1
NRST  (via drill 0.5)
  Top 0.254: U2.7 43.75,51.82 44.13,52.07 v44.13,53.02 | v43.18,60.01 44.13,60.96 51.44,60.96 52.07,60.33 59.69,60.33 60.64,59.37 60.64,47.15 59.89,46.4 X2.5
  Bottom 0.254: v44.13,53.02 43.18,53.98 v43.18,60.01
OSC_IN
  Top 0.254: C11.1 39.41,55.46 Y2.1 40.01,54.61 41.78,52.83 U2.5
P1
  Top 0.254: JP15.1 R2.1
P2
  Top 0.254: R3.1 JP15.3
P3
  Top 0.254: R4.1 JP16.1
P4
  Top 0.254: JP16.3 R5.1
P5
  Top 0.254: R6.1 JP17.1
P6
  Top 0.254: R7.1 JP17.3
P7
  Top 0.254: R8.1 34.71,31.33 JP18.1
P8
  Top 0.254: R9.1 JP18.3
P9
  Top 0.254: JP19.1 R10.1
P10
  Top 0.254: JP19.3 R11.1
P11
  Top 0.254: R12.1 JP20.1
P12
  Top 0.254: JP20.3 57.15,62.23 R13.1
P13
  Top 0.254: JP23.1 R14.1
P14
  Top 0.254: JP23.3 57.57,38.73 R15.1
P15
  Top 0.254: JP24.1 56.73,31.11 R16.1
P16
  Top 0.254: JP24.3 56.73,23.71 R17.1
PORT0  (via drill 0.5)
  Top 0.254: R2.2 C8.1 42.55,75.78 v42.55,70.48 | v40.32,43.5 40.64,43.18 43.18,43.18 45.4,40.96 46.04,40.96 46.74,40.26 U1.19
  Bottom 0.254: v42.55,70.48 42.23,70.17 42.23,62.23 40.01,60.01 40.01,43.81 v40.32,43.5
PORT1  (via drill 0.5)
  Top 0.254: R3.2 C9.1 39.69,74.3 v40.32,73.66 | v39.69,42.55 42.86,42.55 45.09,40.32 45.72,40.32 46.24,39.8 U1.20
  Bottom 0.254: v40.32,73.66 41.59,72.39 41.59,62.55 39.37,60.33 39.37,42.86 v39.69,42.55
PORT2  (via drill 0.5)
  Top 0.254: C12.1 R4.2 v40.01,69.22 | U1.21 45.74,39.35 45.4,39.69 44.77,39.69 42.86,41.59 v40.32,41.59
  Bottom 0.254: v40.32,41.59 39.37,41.59 38.73,42.23 38.73,60.64 40.96,62.87 40.96,68.26 v40.01,69.22
PORT3  (via drill 0.5)
  Top 0.254: R5.2 C13.1 39.05,61.59 v40.96,59.69 | U1.25 42.65,37.04 v41.91,37.78
  Bottom 0.254: v41.91,37.78 41.91,43.18 40.64,44.45 40.64,59.37 v40.96,59.69
PORT4
  Top 0.254: R6.2 C14.1 39.37,41.27 40.01,40.64 40.01,36.83 40.8,36.04 U1.27
PORT5
  Top 0.254: U1.28 42.72,35.56 40.32,35.56 39.37,36.51 C15.1 R7.2
PORT6
  Top 0.254: U1.30 39.94,34.54 39.05,33.66 R8.2 36.41,32.38 C16.1
PORT7
  Top 0.254: U1.31 40.07,34.04 38.73,32.7 38.73,26.45 R9.2 C17.1
PORT8
  Top 0.254: U1.32 40.21,33.54 39.37,32.7 39.37,27.94 40.01,27.3 40.01,23.81 42.23,21.59 53.76,21.59 R17.2 55.03,22.44 56.2,21.27 C25.1
PORT9
  Top 0.254: U1.33 40.66,33.04 40.01,32.38 40.01,28.26 40.64,27.62 40.64,24.13 42.55,22.23 52.7,22.23 55.66,25.18 55.66,26.67 C24.1 R16.2
PORT10
  Top 0.254: U1.35 41.88,32.04 41.27,31.43 41.27,24.45 42.86,22.86 52.39,22.86 55.24,25.72 55.24,27.3 55.4,27.46 55.4,34.66 C23.1 | C23.1 56.2,35.56 | R15.2 C23.1
PORT11  (via drill 0.5)
  Top 0.254: U1.36 42.34,31.54 41.91,31.11 41.91,24.77 43.18,23.5 51.75,23.5 v53.66,25.4 | R14.2 C22.1 55.03,40.96 v55.66,40.32
  Bottom 0.254: v53.66,25.4 54.29,25.4 56.52,27.62 56.52,35.88 55.88,36.51 55.88,40.11 v55.66,40.32
PORT12  (via drill 0.5)
  Top 0.254: C21.1 R13.2 54.93,61.7 v54.93,61.28 | v54.29,26.67 53.34,26.67 50.8,24.13 43.5,24.13 42.55,25.08 42.55,29.21 43.38,30.04 U1.37
  Bottom 0.254: v54.29,26.67 55.88,28.26 55.88,35.56 55.24,36.2 55.24,39.37 54.61,40.01 54.61,40.96 55.24,41.59 55.24,60.96 v54.93,61.28
PORT13  (via drill 0.5)
  Top 0.254: U1.40 45.74,28.28 45.09,27.62 45.09,26.83 46.99,24.92 50.64,24.92 53.66,27.94 v54.29,27.94 | 54.93,69.43 54.83,69.43 | v54.29,68.74 R12.2 55.03,69.33 54.93,69.43 | C20.1 56.3,70.91 54.93,69.53 54.93,69.43
  Bottom 0.254: v54.29,27.94 55.24,28.89 55.24,35.24 54.61,35.88 54.61,39.05 53.98,39.69 53.98,41.27 54.61,41.91 54.61,60.33 53.98,60.96 53.98,68.42 v54.29,68.74
PORT14  (via drill 0.5)
  Top 0.254: U1.42 46.74,26.29 47.47,25.56 50.32,25.56 53.98,29.21 v54.29,29.21
  Top 0.406: C19.1 55.03,75.25 v55.35,75.56 55.03,75.88 R11.2
  Bottom 0.254: v54.29,29.21 54.61,29.53 54.61,34.92 53.98,35.56 53.98,38.73 53.34,39.37 53.34,41.59 53.98,42.23 53.98,60.01 53.34,60.64 53.34,69.22 55.24,71.12 55.24,75.46 v55.35,75.56
PORT15  (via drill 0.5)
  Top 0.254: R10.2 C18.1 53.02,77.37 v53.02,72.39 | U1.43 47.24,26.74 47.78,26.19 50.01,26.19 53.66,29.84 v53.66,30.16
  Bottom 0.254: v53.66,30.16 53.98,30.48 53.98,34.61 53.34,35.24 53.34,38.42 52.7,39.05 52.7,41.91 53.34,42.55 53.34,59.69 52.7,60.33 52.7,69.53 53.98,70.8 53.98,71.44 v53.02,72.39
PORT16  (via drill 0.5)
  Top 0.254: U1.45 48.24,28.28 48.9,27.62 v48.9,26.99 | R22.2 C26.1 42.33,19.9 43.18,19.05 48.26,19.05 v49.21,20
  Bottom 0.254: v48.9,26.99 49.53,26.35 49.53,20.32 v49.21,20
PORT17  (via drill 0.5)
  Top 0.254: U1.46 48.74,28.73 v49.85,27.62 | R23.2 C27.1 42.33,17.36 42.86,16.83 47.94,16.83 49.85,18.73 v49.85,19.05
  Bottom 0.254: v49.85,27.62 50.16,27.3 50.16,19.37 v49.85,19.05
PORT18  (via drill 0.5)
  Top 0.254: U1.47 49.24,29.18 49.53,28.89 50.16,28.89 v50.48,28.57 | v52.07,5.71 54.4,5.71 R18.2
  Bottom 0.254: v50.48,28.57 50.8,28.26 50.8,6.99 v52.07,5.71
PORT19  (via drill 0.5)
  Top 0.254: U1.1 51.24,31.24 v50.8,30.8 | v52.7,6.99 58.63,6.99 R21.2
  Bottom 0.254: v50.8,30.8 50.8,29.53 51.44,28.89 51.44,8.26 v52.7,6.99
SWCLK
  Top 0.254: 49.73,56.4 U2.37 51.23,57.78 54.29,57.78 55.24,56.83 55.24,53.34 58.44,50.15 X2.2
SWDIO
  Top 0.254: U2.34 52.22,53.82 58.4,47.65 X2.4
TLC_BLANK  (via drill 0.5)
  Top 0.254: U3.2 47.47,72.54 v47.94,72.07 | U2.25 47.19,49.33 v46.35,50.16
  Bottom 0.254: v47.94,72.07 47.94,71.12 48.26,70.8 48.26,53.98 46.99,52.7 46.99,50.8 v46.35,50.16
TLC_GSCLK  (via drill 0.5)
  Top 0.254: U2.30 49.28,51.82 v49.05,51.59 | U3.25 50.58,71.22 v50.64,71.28
  Bottom 0.254: v49.05,51.59 49.05,52.86 50.16,53.98 50.16,55.24 49.53,55.88 49.53,70.48 50.32,71.28 v50.64,71.28
TLC_MODE  (via drill 0.5)
  Top 0.254: U3.6 44.72,69.9 v45.4,69.22 | v44.77,54.29 44.93,54.29 48.42,50.8 49.53,50.8 50.04,51.31 U2.29
  Bottom 0.254: v45.4,69.22 45.72,68.9 45.72,56.52 44.77,55.56 v44.77,54.29
TLC_SCLK  (via drill 0.5)
  Top 0.254: U3.4 45.94,71.22 v46.04,71.12 | U2.26 47.82,49.81 46.51,51.12 v45.4,51.12
  Bottom 0.254: v46.04,71.12 46.99,70.17 46.99,55.88 46.35,55.24 46.35,52.07 v45.4,51.12
TLC_SIN  (via drill 0.5)
  Top 0.254: U3.5 45.33,70.56 v45.72,70.17 | U2.28 50.19,50.83 49.69,50.32 48.1,50.32 46.04,52.39 v45.09,52.39
  Bottom 0.254: v45.72,70.17 46.35,69.53 46.35,56.2 45.72,55.56 45.72,53.02 v45.09,52.39
TLC_SOUT  (via drill 0.5)
  Top 0.254: U2.27 v52.54,50.32 | U3.24 52.3,70.56 v53.02,71.28
  Bottom 0.254: v52.54,50.32 52.7,50.48 52.7,59.37 52.07,60.01 52.07,69.85 53.02,70.8 v53.02,71.28
TLC_XERR  (via drill 0.5)
  Top 0.254: v49.37,54.45 49.37,53.66 50.2,52.83 U2.32 | v48.9,71.44 48.9,70.48 49.48,69.9 U3.23 | v48.9,77.15 R28.2
  Bottom 0.254: v49.37,54.45 48.9,54.93 v48.9,71.44 v48.9,77.15
TLC_XLAT  (via drill 0.5)
  Top 0.254: U3.3 46.86,71.88 v46.99,71.75 | v47.31,54.45 49.44,52.32 U2.31
  Bottom 0.254: v46.99,71.75 46.99,71.12 47.62,70.48 47.62,55.56 47.31,55.24 v47.31,54.45
TOP_+12V
  pour Top: -1.27,100.33 29.21,100.33 29.21,-1.27 -1.27,-1.27
TOP_GND
  pour Bottom: -1.27,100.33 29.21,100.33 29.21,-1.27 -1.27,-1.27
TOP_LED1
  Top 0.406: JP6.2 6.35,79.38 10.79,83.82 10.79,88.9 LED1.K
TOP_LED2
  Top 0.406: JP6.4 8.89,74.3 LED2.K
TOP_LED3
  Top 0.406: JP7.2 11.43,66.67 LED3.K
TOP_LED4
  Top 0.406: JP7.4 8.57,61.59 10.16,60.01 10.16,55.24 LED4.K
TOP_LED5
  Top 0.406: JP8.2 11.43,41.27 LED5.K
TOP_LED6
  Top 0.406: JP8.4 8.57,36.2 10.16,34.61 10.16,29.84 LED6.K
TOP_LED7
  Top 0.406: JP9.2 5.71,28.57 11.11,23.18 11.11,16.19 LED7.K
TOP_LED8
  Top 0.406: LED8.K 12.7,2.54 11.43,3.81 3.81,3.81 0.64,6.99 0.64,22.23 JP9.4
TOP_LED9
  Top 0.406: JP10.2 21.91,79.38 17.78,83.5 LED9.K
TOP_LED10
  Top 0.406: JP10.4 21.59,74.3 LED10.K
TOP_LED11
  Top 0.406: JP11.2 19.05,66.67 LED11.K
TOP_LED12
  Top 0.406: JP11.4 19.37,61.59 17.78,60.01 LED12.K
TOP_LED13
  Top 0.406: JP12.2 19.05,41.27 LED13.K
TOP_LED14
  Top 0.406: JP12.4 19.37,36.2 17.78,34.61 LED14.K
TOP_LED15
  Top 0.406: JP13.2 22.23,28.57 16.83,23.18 16.83,15.56 LED15.K
TOP_LED16
  Top 0.406: LED16.K 23.5,1.91 27.3,5.71 27.3,22.23 JP13.4
TOP_P1
  Top 0.406: JP6.1 0.64,83.19 0.64,85.25 P1.P$3
TOP_P2
  Top 0.406: JP6.3 5.4,76.83 12.38,83.82 12.38,84.3 P2.P$3
TOP_P3
  Top 0.406: JP7.1 10,69.22 P3.P$3
TOP_P4
  Top 0.406: JP7.3 7.46,64.14 P4.P$3
TOP_P5
  Top 0.406: JP8.1 10,43.81 P5.P$3
TOP_P6
  Top 0.406: JP8.3 7.46,38.73 P6.P$3
TOP_P7
  Top 0.406: JP9.1 4.45,31.11 12.06,23.5 12.06,21.43 P7.P$3
TOP_P8
  Top 0.406: JP9.3 6.99,26.04 10.16,22.86 10.16,18.41 8.89,17.14 8.89,11.9 P8.P$3
TOP_P9
  Top 0.406: JP10.1 27.3,83.19 27.3,85.25 P9.P$3
TOP_P10
  Top 0.406: JP10.3 23.02,76.83 P10.P$3
TOP_P11
  Top 0.406: JP11.1 17.94,69.22 P11.P$3
TOP_P12
  Top 0.406: JP11.3 20.48,64.14 P12.P$3
TOP_P13
  Top 0.406: JP12.1 17.94,43.81 P13.P$3
TOP_P14
  Top 0.406: JP12.3 20.48,38.73 P14.P$3
TOP_P15
  Top 0.406: JP13.1 23.5,31.11 15.24,22.86 15.24,21.11 P15.P$3
TOP_P16
  Top 0.406: JP13.3 20.95,26.04 17.78,22.86 17.78,17.78 19.05,16.51 19.05,11.9 P16.P$3
USART1_RX
  Top 0.254: U2.43 46.74,57.37 49.05,59.69 57.88,59.69 CN1.3
USART1_TX
  Top 0.254: U2.42 47.24,57.09 49.37,59.21 54.77,59.21 56.52,57.47 56.52,55.88 57.88,54.52 CN1.1

### Text on the board
tPlace: Porter | Rev01 | Rebel | Tech | Porter | Rev01
bPlace: Rebel Technology | Porter Rev01